# Altium schematic sheet Microcontroller_schematic.SchDoc: Science Sensor: Microcontroller
size B; ENG_APP_DATE: --/--/--; DSN_APP_DATE: --/--/--; CHK_APP_DATE: --/--/--; Author: Emela M.; Organization: Husky Robotics; Address1: University of Washington; Address2: Mechanical Engineering; Address3: Seattle, WA; Address4: Australia 2086; Revision: A; SheetNumber: 1; SheetTotal: 6
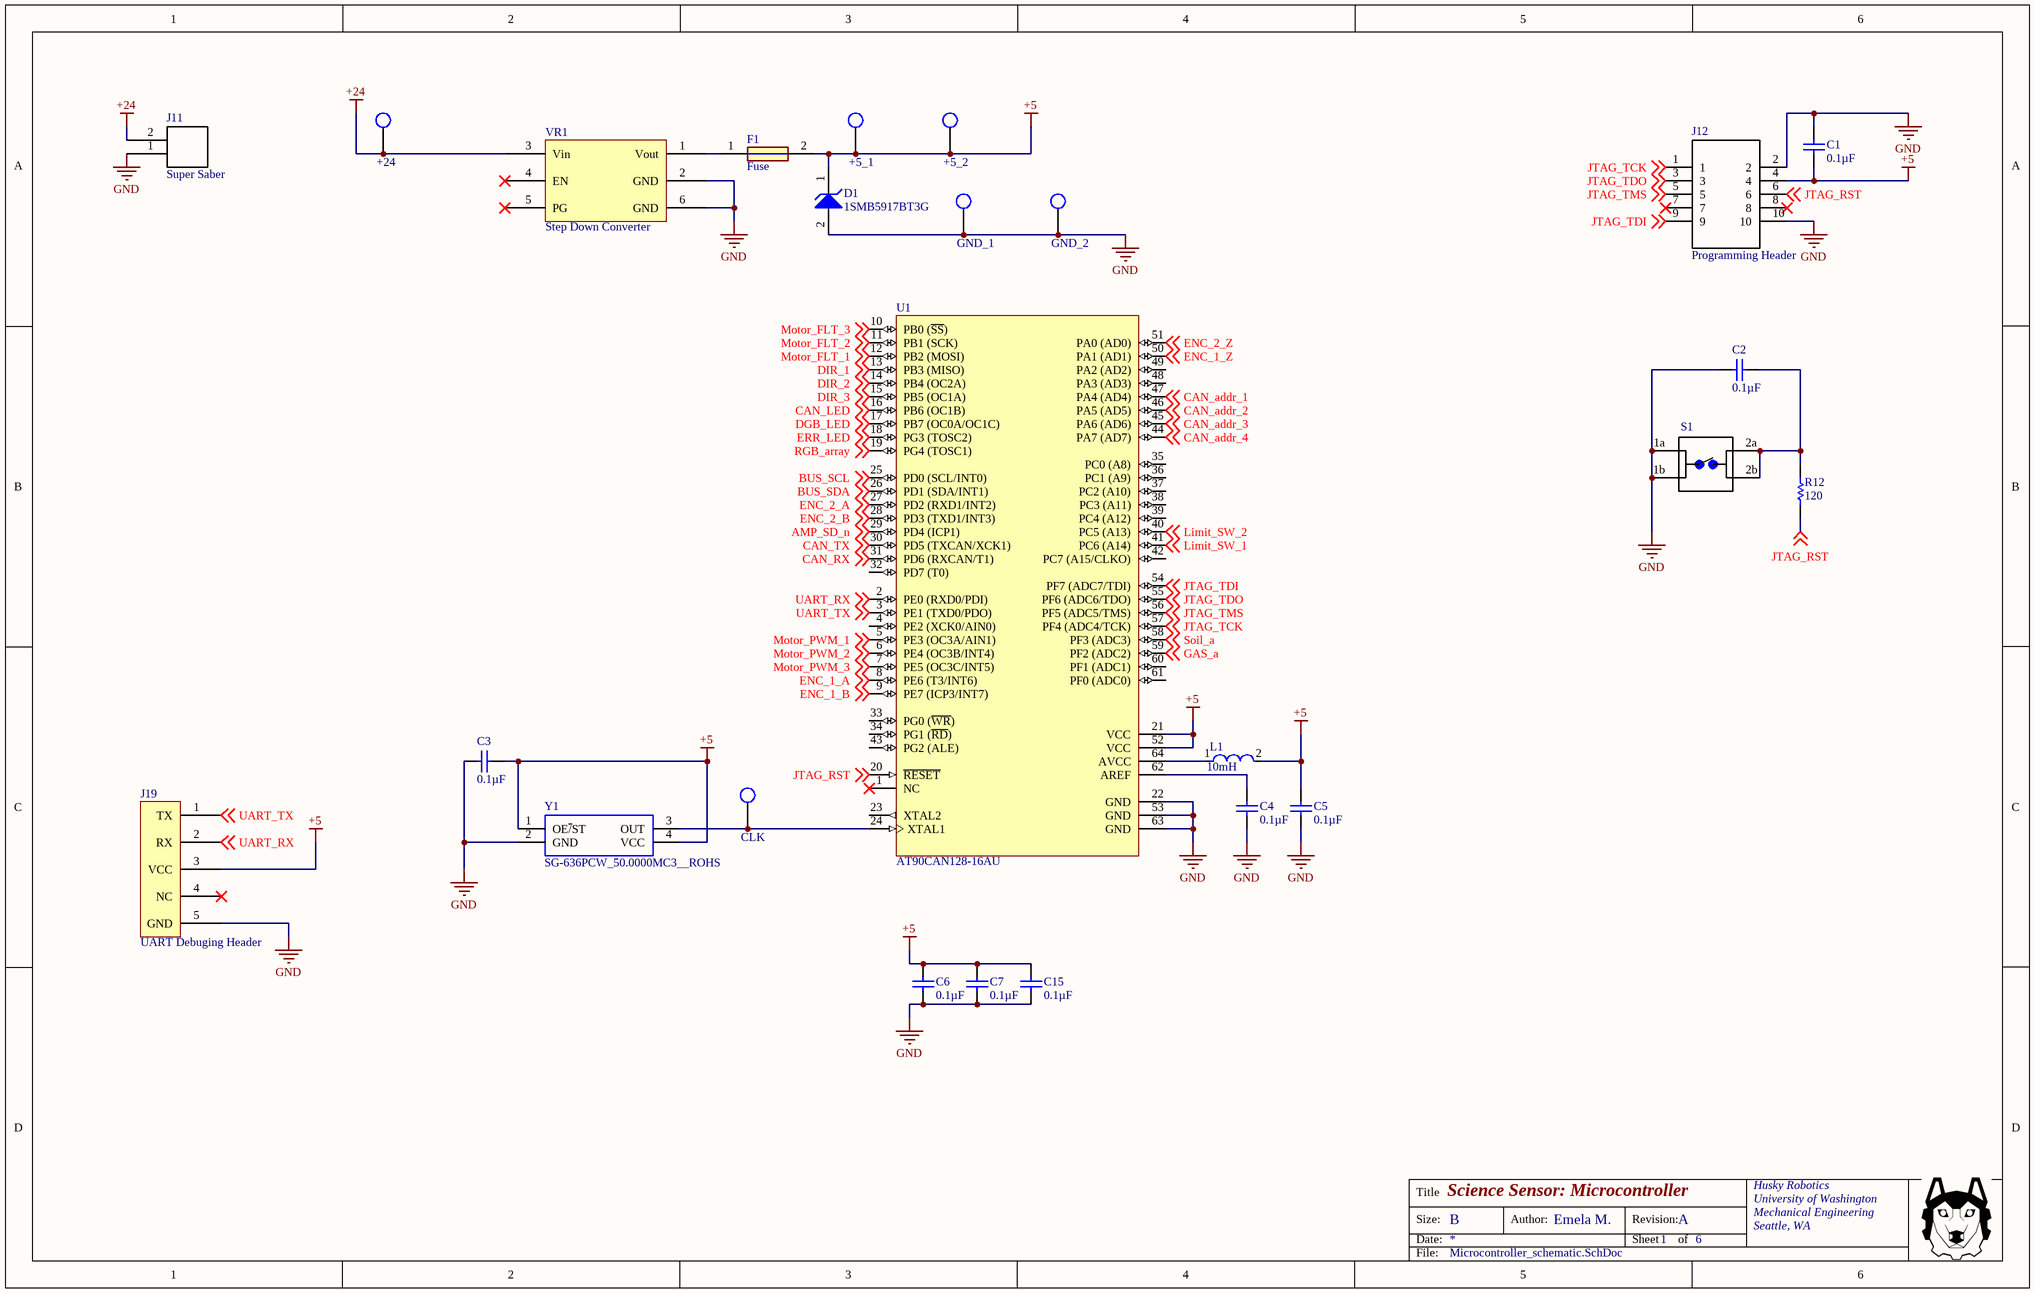
[diagram p0: Microcontroller_schematic.SchDoc]

## Parts
+5_1  Test Point  [Test Point Through-hole]  (value not drawn)
+5_2  Test Point  [Test Point Through-hole]  (value not drawn)
+24  Test Point  [Test Point Through-hole]  (value not drawn)
C1  Capacitance: 0.1µF  [Cap 0805]  (hidden comment: Capacitor 0805)
C2  Capacitance: 0.1µF  [Cap 0805]  (hidden comment: Capacitor 0805)
C3  Capacitance: 0.1µF  [Cap 0805]  (hidden comment: Capacitor 0805)
C4  Capacitance: 0.1µF  [Cap 0805]  (hidden comment: Capacitor 0805)
C5  Capacitance: 0.1µF  [Cap 0805]  (hidden comment: Capacitor 0805)
C6  Capacitance: 0.1µF  [Cap 0805]  (hidden comment: Capacitor 0805)
C7  Capacitance: 0.1µF  [Cap 0805]  (hidden comment: Capacitor 0805)
C15  Capacitance: 0.1µF  [Cap 0805]  (hidden comment: Capacitor 0805)
CLK  Test Point  [Test Point Through-hole]  (value not drawn)
D1  1SMB5917BT3G  [ONSC-SMB-2-403A-03_H_V]
F1  Fuse  [Fuse_Through_Hole - duplicate]
GND_1  Test Point  [Test Point Through-hole]  (value not drawn)
GND_2  Test Point  [Test Point Through-hole]  (value not drawn)
J11  Super Saber  [SuperSaber R/A]
J12  Programming Header  [programming3D]
J19  UART Debuging Header  [UART Debugging Header]
L1  10mH  [FP-CV201210-R10K-MFG]
R12  value 120  [RESC0805(2012)_N]  (hidden comment: Resistor 0805)
S1  1825910-7  [Switch 6mm 24V (NO)]  (value not drawn)
U1  AT90CAN128-16AU  [64A_M]
VR1  Step Down Converter  [24V-5V Converter]
Y1  SG-636PCW_50.0000MC3__ROHS  [SG-636_3D]

## Nets
+5: +5_1.1 +5_2.1 C1.1 C3.2 C5.2 C6.2 C7.2 C15.2 D1.1(K) F1.2 J12.4 J19.3(VCC) L1.2 U1.21(VCC) U1.52(VCC) Y1.1(OE~{/}ST) Y1.4(VCC)
+24: +24.1 J11.2 VR1.3(Vin)
GND: C1.2 C2.1 C3.1 C4.1 C5.1 C6.1 C7.1 C15.1 D1.2(A) GND_1.1 GND_2.1 J11.1 J12.2 J12.10 J19.5(GND) S1.1a S1.1b U1.22(GND) U1.53(GND) U1.63(GND) VR1.2(GND) VR1.6(GND) Y1.2(GND)
AMP_SD_n: U1.29(PD4_(ICP1)) ; off-sheet AMP_SD_n
BUS_SCL: U1.25(PD0_(SCL/INT0)) ; off-sheet BUS_SCL
BUS_SDA: U1.26(PD1_(SDA/INT1)) ; off-sheet BUS_SDA
CAN_addr_1: U1.47(PA4_(AD4)) ; off-sheet CAN_addr_1
CAN_addr_2: U1.46(PA5_(AD5)) ; off-sheet CAN_addr_2
CAN_addr_3: U1.45(PA6_(AD6)) ; off-sheet CAN_addr_3
CAN_addr_4: U1.44(PA7_(AD7)) ; off-sheet CAN_addr_4
CAN_LED: U1.16(PB6_(OC1B)) ; off-sheet CAN_LED
CAN_RX: U1.31(PD6_(RXCAN/T1)) ; off-sheet CAN_RX
CAN_TX: U1.30(PD5_(TXCAN/XCK1)) ; off-sheet CAN_TX
DGB_LED: U1.17(PB7_(OC0A/OC1C)) ; off-sheet DGB_LED
DIR_1: U1.13(PB3_(MISO)) ; off-sheet DIR_1
DIR_2: U1.14(PB4_(OC2A)) ; off-sheet DIR_2
DIR_3: U1.15(PB5_(OC1A)) ; off-sheet DIR_3
ENC_1_A: U1.8(PE6_(T3/INT6)) ; off-sheet ENC_1_A
ENC_1_B: U1.9(PE7_(ICP3/INT7)) ; off-sheet ENC_1_B
ENC_1_Z: U1.50(PA1_(AD1)) ; off-sheet ENC_1_Z
ENC_2_A: U1.27(PD2_(RXD1/INT2)) ; off-sheet ENC_2_A
ENC_2_B: U1.28(PD3_(TXD1/INT3)) ; off-sheet ENC_2_B
ENC_2_Z: U1.51(PA0_(AD0)) ; off-sheet ENC_2_Z
ERR_LED: U1.18(PG3_(TOSC2)) ; off-sheet ERR_LED
GAS_a: U1.59(PF2_(ADC2)) ; off-sheet GAS_a
JTAG_RST: J12.6 R12.1 U1.20(~{RESET}) ; off-sheet JTAG_RST
JTAG_TCK: J12.1 U1.57(PF4_(ADC4/TCK)) ; off-sheet JTAG_TCK
JTAG_TDI: J12.9 U1.54(PF7_(ADC7/TDI)) ; off-sheet JTAG_TDI
JTAG_TDO: J12.3 U1.55(PF6_(ADC6/TDO)) ; off-sheet JTAG_TDO
JTAG_TMS: J12.5 U1.56(PF5_(ADC5/TMS)) ; off-sheet JTAG_TMS
Limit_SW_1: U1.41(PC6_(A14)) ; off-sheet Limit_SW_1
Limit_SW_2: U1.40(PC5_(A13)) ; off-sheet Limit_SW_2
Motor_FLT_1: U1.12(PB2_(MOSI)) ; off-sheet Motor_FLT_1
Motor_FLT_2: U1.11(PB1_(SCK)) ; off-sheet Motor_FLT_2
Motor_FLT_3: U1.10(PB0_(~{SS})) ; off-sheet Motor_FLT_3
Motor_PWM_1: U1.5(PE3_(OC3A/AIN1)) ; off-sheet Motor_PWM_1
Motor_PWM_2: U1.6(PE4_(OC3B/INT4)) ; off-sheet Motor_PWM_2
Motor_PWM_3: U1.7(PE5_(OC3C/INT5)) ; off-sheet Motor_PWM_3
RGB_array: U1.19(PG4_(TOSC1)) ; off-sheet RGB_array
Soil_a: U1.58(PF3_(ADC3)) ; off-sheet Soil_a
UART_RX: J19.2(RX) U1.2(PE0_(RXD0/PDI)) ; off-sheet UART_RX
UART_TX: J19.1(TX) U1.3(PE1_(TXD0/PDO)) ; off-sheet UART_TX
NetC2_2: C2.2 R12.2 S1.2a S1.2b
NetC4_2: C4.2 U1.62(AREF)
NetCLK_1: CLK.1 U1.24(XTAL1) Y1.3(OUT)
NetF1_1: F1.1 VR1.1(Vout)
NetL1_1: L1.1 U1.64(AVCC)

Not connected (* = marked no-connect by the designer): J12 7* 8*; J19 4(NC)*; U1 1(NC)* 4(PE2_(XCK0/AIN0)) 23(XTAL2) 32(PD7_(T0)) 33(PG0_(~{WR})) 34(PG1_(~{RD})) 35(PC0_(A8)) 36(PC1_(A9)) 37(PC2_(A10)) 38(PC3_(A11)) 39(PC4_(A12)) 42(PC7_(A15/CLKO)) 43(PG2_(ALE)) 48(PA3_(AD3)) 49(PA2_(AD2)) 60(PF1_(ADC1)) 61(PF0_(ADC0)); VR1 4(EN)* 5(PG)*

## Notes on the sheet
- Title
- Size:
- Date:
- B
- Author:
- Revision:
- Sheet
- of
- File:

## Library data of the parts
C1-C7 C15 = Capacitor 0805: Standard Capacitor; Manufacturer: AVX; Tolerance (%): ±10%; Dielectric: X5R; Rated Voltage: 10V; Datasheet Version: 05/2016; Manufacturer URL: http://www.avx.com/; Package Description: 2-Pin Surface Mount Device, Body 2.01 x 1.25 mm; Mounting Technology: SurfaceMount; Case Size/Dimension: 0805; Package Reference: 0805; Datasheet URL: http://datasheets.avx.com/cx5r.pdf
D1 = Zener Diode 5.1V: 3 W Zener Voltage Regulator, 2-Pin SMB, Pb-Free, Tape and Reel; Manufacturer: On Semiconductor; VZ Typ (V): 4.7; RoHS: Pb-Free; ComponentLink1Description: Manufacturer URL; ComponentLink2URL: http://www.onsemi.com/pub_link/Collateral/1SMB5913BT3-D.PDF; Mounting Technology: Surface Mount; PackageVersion: Rev. H, 05/2011; DatasheetVersion: Rev. 8; Packing: Tape and Reel; PartNumber: 1SMB5917BT3G; ComponentLink2Description: Datasheet; ComponentLink3Description: Package Specification; PackageReference: SMB-2-403A-03_H; ComponentLink1URL: http://www.onsemi.com/; PackageDescription: 2-Pin Small Molded Package, J-Bend Lead, Body 4.33 x 3.625 mm; ComponentLink3URL: http://www.onsemi.com/pub_link/Collateral/1SMB5913BT3-D.PDF
L1 = CMP-07248-000019-1: FIXED IND 100NH 250MA 300 MOHM; Manufacturer: Bourns; Manufacturer Part Number: CV201210-R10K; Value: 0.1uH; Core Material: Ferrite; Tolerance: 10%; Test Frequency: 25MHz; Self Resonant Frequency: 235MHz; Q Factor: 20; Series Resistance: 300mΩ; Shielding: true; ComponentLink2Description: Datasheet; Ipc Land Pattern Name: CAPC200125X85; ComponentLink2URL: https://www.bourns.com/docs/product-datasheets/cv201210.pdf?sfvrsn=f7844854_5; RoHS: TRUE; Device Class L3: Fixed Inductors; Octopart: https://octopart.com/cv201210-r10k-bourns-2076708; Lead Free: Yes; Device Class L2: Inductors; Temperature: -55°C to +125°C; Height: 1.05mm; Automotive: No; Inductance: 0.1uH; Temperature Range High: +125°C; Category: Ind; Package: CV201210-R10K; Digikey Description: FIXED IND 100NH 250MA 300 MOHM; Device Class L1: Passive Components; Rms Current: 250mA; Mouser Description: Fixed Inductors .1uH 10% MULTI LAYER; Temperature Range Low: -55°C; Composition: Multilayer
R12 = Resistor 0805: Generic 0805 Resistor; Tolerance: 5 %; Case-Metric: 2012; Case-EIA: 0805; Power: 0.125 W; Technology: SMT
S1 = Switch 6mm 24V (NO): FSM4JAH=6MM TACT SWITCH, HIGH TEMP; MF: TE Connectivity; Contact_Current_Rating: 50 mA; Configuration_Pole-Throw: Single Pole - Single Throw; Package: None; Digi-Key_Part_Number: 450-1804-ND; Digi-Key_Purchase_URL: https://www.digikey.com/product-detail/en/te-connectivity-alcoswitch-switches/1825910-7/450-1804-ND/1731414?utm_source=snapeda&utm_medium=aggregator&utm_campaign=symbol; MP: 1825910-7; SnapEDA_Link: https://www.snapeda.com/parts/1825910-7/TE%20Connectivity%20ALCOSWITCH%20Switches/view-part/?ref=snap; EU_RoHS_Compliance: Compliant; TE_purchase_URL: https://www.te.com/usa-en/product-1825910-7.html?te_bu=Cor&te_type=disp&te_campaign=seda_glo_cor-seda-global-disp-prtnr-fy19-seda-model-bom-cta_sma-317_1&elqCampaignId=32493; Value: *
U1 = CMP-0096-00104-2: 8-bit AVR Microcontroller, 128KB Flash and CAN Controller, 53 GPIO pins, Industrial Grade (-40° to +85°C), 64-pin LQFP, Green; PackageVersion: revC, Oct-2010; ComponentLink1Description: Manufacturer URL; ComponentLink3Description: AT90CAN32/64/128 Summary; ComponentLink2Description: AT90CAN32/64/128 Datasheet; Code_JEDEC: MS-026-AEB; DatasheetVersion: revH, Aug-2008; ComponentLink2URL: http://www.atmel.com/dyn/resources/prod_documents/doc7679.pdf; ComponentLink3URL: http://www.atmel.com/dyn/resources/prod_documents/7679S.pdf; ComponentLink1URL: http://www.atmel.com/; RevisionNote: PackageVersion updated. URLs added.; PackageReference: 64A; PackageDescription: 64-Pin Plastic Thin Profile Quad Flat Pack, 14 x 14 x 1.0 mm Body, 0.8 mm Pitch (TQFP)
VR1 = 24V-5V Pololu 2858
Y1 = Oscilator: Standard Clock Oscillators; Manufacturer_Name: Epson Timing; Manufacturer_Part_Number: SG-636PCW 50.0000MC3: ROHS; RS Part Number: *; RS Price/Stock: *; Arrow Part Number: SG-636PCW 50.0000MC3: ROHS; Arrow Price/Stock: *; Datasheet Link: http://www.mouser.com/ds/2/137/G-636PCE_en-1003252.pdf